# Altium schematic sheet Micro.SchDoc: Comms Board Power
size A3; DrawnBy: Scott Camp and Finn Molloy; Address1: ECE Department; Address2: University of Canterbury; Address3: Christchurch 8041; Address4: New Zealand; Revision: 1
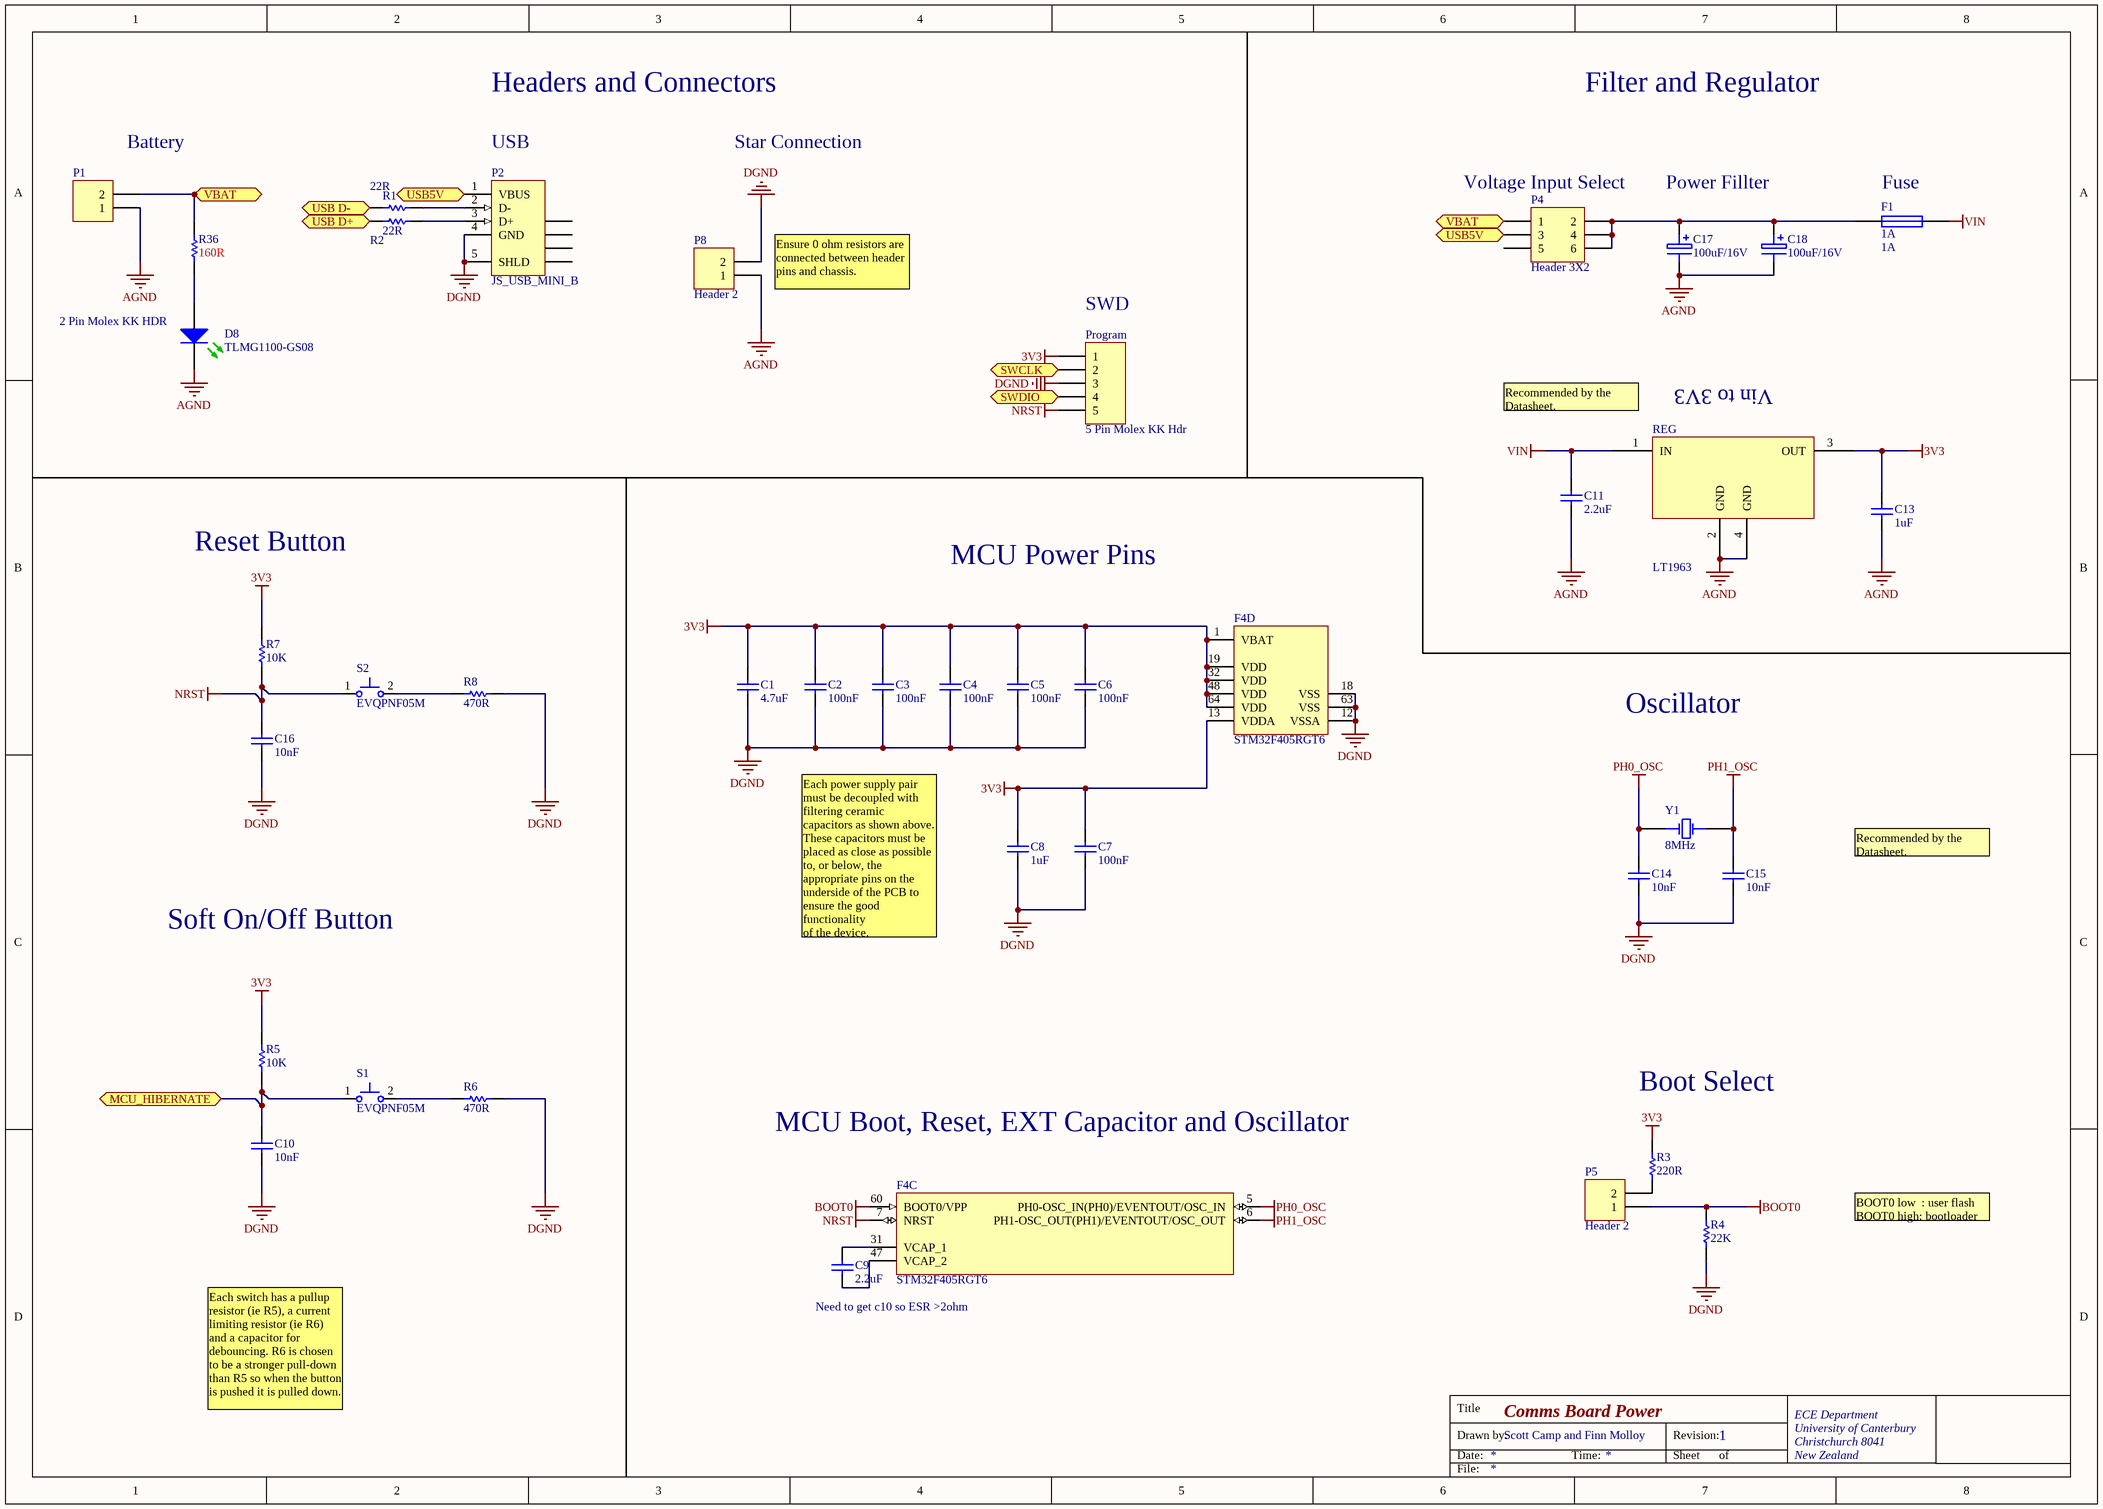
[diagram p0: Micro.SchDoc]

## Parts
C1  4.7uF  [CAPC2012L]
C2  100nF  [CAPC1005L]
C3  100nF  [CAPC1005L]
C4  100nF  [CAPC1005L]
C5  100nF  [CAPC1005L]
C6  100nF  [CAPC1005L]
C7  100nF  [CAPC1005L]
C8  1uF  [CAPC1608L]
C9  2.2uF  [CAPC2012L]
C10  10nF  [CAPC1608L]
C11  2.2uF  [CAPC2012L]
C13  1uF  [CAPC1608L]
C14  10nF  [CAPC1608L]
C15  10nF  [CAPC1608L]
C16  10nF  [CAPC1608L]
C17  100uF/16V  [NICH-1]
C18  100uF/16V  [NICH-1]
D8  TLMG1100-GS08  [LED0.8X1.6]
F1  1A  [RESC3216N]
F4  STM32F405RGT6  [TQFP64_V]  (parts C,D of 4)
P1  2 Pin Molex KK HDR  [MOLEX_KK_2_HDR]
P2  JS_USB_MINI_B  [USB/SM0.8-6H5]
P4  Header 3X2  [HDR2X3]
P5  Header 2  [HDR1X2]
P8  Header 2  [HDR1X2]
Program  5 Pin Molex KK Hdr  [MOLEX_KK_5_HDR]
R1  22R  [RESC1608L]
R2  22R  [RESC1608L]
R3  220R  [RESC1608L]
R4  22K  [RESC1608L]
R5  10K  [RESC1608L]
R6  470R  [RESC1608L]
R7  10K  [RESC1608L]
R8  470R  [RESC1608L]
R36  160R  [RESC1608L]
REG  LT1963  [SOT223-4M]
S1  EVQPNF05M  [EVQPNF05M]
S2  EVQPNF05M  [EVQPNF05M]
Y1  8MHz  [HC49/4h_SMX]

## Ports
MCU_HIBERNATE (bidir), SWCLK (bidir), SWDIO (bidir), USB5V (bidir), USB D+ (bidir), USB D- (bidir), VBAT (bidir)

## Nets
3V3: C1.2 C2.2 C3.2 C4.2 C5.2 C6.2 C7.2 C8.2 C13.2 F4.1(VBAT) F4.13(VDDA) F4.19(VDD) F4.32(VDD) F4.48(VDD) F4.64(VDD) Program.1 R3.2 R5.2 R7.2 REG.3(OUT)
AGND: C11.2 C13.1 C17.1 C18.1 D8.2(K) P1.1 P8.1 REG.2(GND) REG.4(GND)
BOOT0: F4.60(BOOT0/VPP) P5.1 R4.2
DGND: C1.1 C2.1 C3.1 C4.1 C5.1 C6.1 C7.1 C8.1 C10.1 C14.1 C15.1 C16.1 F4.12(VSSA) F4.18(VSS) F4.63(VSS) P2.4(GND) P2.5(SHLD) P8.2 Program.3 R4.1 R6.2 R8.2
NRST: C16.2 F4.7(NRST) Program.5 R7.1 S2.1
PH0_OSC: C14.2 F4.5(PH0-OSC_IN(PH0)/EVENTOUT/OSC_IN) Y1.1(OSC1)
PH1_OSC: C15.2 F4.6(PH1-OSC_OUT(PH1)/EVENTOUT/OSC_OUT) Y1.2(OSC2)
VIN: C11.1 F1.2 REG.1(IN)
MCU_HIBERNATE: C10.2 R5.1 S1.1 ; port MCU_HIBERNATE
SWCLK: Program.2 ; port SWCLK
SWDIO: Program.4 ; port SWDIO
USB5V: P2.1(VBUS) P4.3 ; port USB5V
USB D+: R2.1 ; port USB D+
USB D-: R1.1 ; port USB D-
VBAT: P1.2 P4.1 R36.2 ; port VBAT
NetC9_1: C9.1 F4.31(VCAP_1)
NetC9_2: C9.2 F4.47(VCAP_2)
NetC17_2: C17.2 C18.2 F1.1 P4.2 P4.4 P4.6
NetD8_1: D8.1(A) R36.1
NetP2_2: P2.2(D-) R1.2
NetP2_3: P2.3(D+) R2.2
NetP5_2: P5.2 R3.1
NetR6_1: R6.1 S1.2
NetR8_1: R8.1 S2.2

Not connected (* = marked no-connect by the designer): P2 6(SHLD) 7(SHLD) 8(SHLD) 9(SHLD); P4 5

## Notes on the sheet
- Headers and Connectors
- Filter and Regulator
- (near P1) Battery
- (near P2) USB
- Star Connection
- (near P4) Voltage Input Select
- Power Fillter
- (near F1) Fuse
- (near P8) Ensure 0 ohm resistors are connected between header pins and chassis.
- (near Program) SWD
- (near REG) Vin to 3V3
- (near REG) Recommended by the Datasheet.
- Reset Button
- MCU Power Pins
- Oscillator
- Recommended by the Datasheet.
- Soft On/Off Button
- Each power supply pair must be decoupled with filtering ceramic capacitors as shown above. These capacitors must be
  placed as close as possible to, or below, the appropriate pins on the underside of the PCB to ensure the good functionality
  of the device.
- Boot Select
- MCU Boot, Reset, EXT Capacitor and Oscillator
- BOOT0 low  : user flash
  BOOT0 high: bootloader
- Need to get c10 so ESR >2ohm
- Each switch has a pullup resistor (ie R5), a current limiting resistor (ie R6) and a capacitor for debouncing. R6 is chosen to be a stronger pull-down than R5 so when the button is pushed it is pulled down.
- Title
- Drawn by:
- Date:
- Time:
- Revision:
- Sheet
- of
- File:

## Library data of the parts
C1 = CC_4.7uF_0805: CAP CER 4.7uF Y5V -20% +80% 16V 0805; Note: Footprint corresponds to dimensions for bulk cassette packaging. This case size has tightened tolerances.; PackageReference: 0805; Code_IPC: 2012[0805]; Verify: *; Supplier: ECE Dept Stock; Storage Location: Pottle; Value: 4.7uF
C2-C7 = CC_100nF_0402: CAP CER 100nF X7R +-10% 16V 0402; PackageReference: 0402; Code_IPC: 1005 [0402]; Verify: *; Supplier: ECE Dept Stock; Storage Location: Pottle; Value: 100nF
C8 C13 = CC_1uF_0603: CAP CER 1uF Y5V -20% +80% 16V 0603; PackageReference: 0603; Code_IPC: 1608 [0603]; Verify: *; Supplier: ECE Dept Stock; Storage Location: Pottle; Value: 1uF
C9 C11 = CC_2.2uF_0805: CAP CER 2.2uF Y5V -20% +80% 25V 0805; Note: Footprint corresponds to dimensions for bulk cassette packaging. This case size has tightened tolerances.; PackageReference: 0805; Code_IPC: 2012[0805]; Verify: *; Supplier: ECE Dept Stock; Storage Location: Pottle; Value: 2.2uF
C10 C14-C16 = CC_10nF_0603: CAP CER 10nF X7R +-10% 50V 0603; PackageReference: 0603; Code_IPC: 1608 [0603]; Verify: *; Supplier: ECE Dept Stock; Storage Location: Pottle; Value: 10nF
C17 C18 = CA_100uF_16V_SMD: Nichcon WX series  SMT Aluminium Electrolytic Cap; Manufacturer PN: UWX1C101MCL1GB; Value: 100uF @ 16V; Manufacturer: Nichcon; Supplier 1: ECE Stock
D8 = DL_TLMG1100: LED Green 0603; Manufacturer: Vishay Semiconductor Opto Division; Millicandela Rating: 35mcd; Voltage - Forward (Vf) Typ: 2.1V; Viewing Angle: 160°; Wavelength - Peak: 572nm; Supplier 1: Farnell; Supplier 2: Digi-Key; Color: Green; Package / Case: 0603 (1608 Metric); Packaging: Cut Tape (CT); Size / Dimension: 1.60mm L x 0.80mm W; Pricing: 1=0.67, 10=0.525, 25=0.4376, 100=0.359, 250=0.29912, 500=0.24852, 1000=0.18408 (NZD); Supplier Part Number 1: 2293494; Supplier Part Number 2: 751-1165-1-ND; Manufacturer Part Number: TLMG1100-GS08
F1 = FS_Fuse_1.0A_SMD_1206: Fuse 1.0A Very Fast Acting 1206; Manufacturer: Multicomp; Manufacturer PN: MC12CF 001; Supplier: Lab Stock; Storage Location: *; Value: 1A
F4 = STM32F405RGT6: ARM Cortex-M4 32b MCU+FPU, 210DMIP, 1024 kB Flash, 192+4 kB RAM, 51 I/Os, 64-pin LQFP, -40 to +85°C, Tray; Internal RAM: 192kB; Operating Frequency (Processor Speed): 168MHz; A/D Converter: 16x12-bit; D/A Converter: 2x12-bit; 16-bit Timers (IC/OC/PWM): 12x16-bit(24/24/30); 32-bit Timer (IC/OC/PWM): 2x32-bit (8/8/8); Other Timer Functions: 2xWDG, RTC, 24-bit down counter; Serial Interface: 3xSPI/2xI2S/2xI2C/3xUSART(IrDa, ISO7816)/3xUART/1xUSB OTG FS/HS, 2xCAN/ SDIO; DatasheetVersion: rev2, Jan-2012; PackageVersion: 2012; PackageReference: TQFP64; PackageDescription: 64-Pin Low Profile Quad Flat Package, 10x10 mm Body, 0.5 mm Pitch; ComponentLink1Description: Manufacturer URL; ComponentLink1URL: http://www.st.com/; ComponentLink2Description: STM32F405/7 Datasheet; ComponentLink2URL: http://www.st.com/internet/com/TECHNICAL_RESOURCES/TECHNICAL_LITERATURE/DATASHEET/DM00037051.pdf; ComponentLink3Description: STM32F4 Web Page; ComponentLink3URL: http://www.st.com/internet/mcu/subclass/1521.jsp
P1 = JA_MOLEX_KK_2POS: CONN HEADER 2POS 2.54mm VERT_Thru Hole; Supplier 1: Farnell; Supplier Part Number 1: 1462926; Supplier 2: ECE Store; Value: 2 Pin Molex KK HDR
P2 = JS_USB_MINI_B_SMT: USB 2.0, Right Angle, SMT, B Type, Receptacle, 5 Position,; Manufacturer: FCI; Manufacturer PN: 10033526-N3212MLF; Supplier 1: Farnell; Supplier Part Number 1: 1824416; Supplier 2: ECE Stock
P4 = Header 3X2: Header, 3-Pin, Dual row; LatestRevisionDate: 17-Jul-2002; LatestRevisionNote: Re-released for DXP Platform.; Publisher: Altium Limited
P5 P8 = Header 2: Header, 2-Pin; LatestRevisionDate: 17-Jul-2002; LatestRevisionNote: Re-released for DXP Platform.; Publisher: Altium Limited
Program = JA_MOLEX_KK_5POS: CONN HEADER 5POS 2.54mm VERT_Thru Hole; Manufacturer: Molex; Manufacturer PN: 22-23-2051; Supplier 1: ECE Dept Store; Value: 5 Pin Molex KK Hdr
R1 R2 = RS_22R: RES 22 OHM 1/10W 5% 0603 SMD; Storage Location: ProtoPlace; Supplier: ECE Dept Stock; Value: 22R
R3 = RS_220R: RES 220 OHM 1/10W 5% 0603 SMD; Storage Location: ProtoPlace; Supplier: ECE Dept Stock; Value: 220R
R4 = RS_22K: RES 22.0K OHM 1/10W 5% 0603 SMD; Storage Location: ProtoPlace; Supplier: ECE Dept Stock; Value: 22K
R5 R7 = RS_10K: RES 10.0K OHM 1/10W 5% 0603 SMD; Storage Location: ProtoPlace; Supplier: ECE Dept Stock; Value: 10K
R6 R8 = RS_470R: RES 470 OHM 1/10W 5% 0603 SMD; Storage Location: ProtoPlace; Supplier: ECE Dept Stock; Value: 470R
R36 = RS_160R: RES 160 OHM 1/10W 5% 0603 SMD; Storage Location: Red Pottel; Supplier: ECE Dept Stock; Value: 160R
S1 S2 = WS_EVQPNF05M: Panasonic 6 x 3.5mm SMD Light Touch Switch Type; PackageDescription: 6.0 x 3.5 mm; Supplier 1: Farnell; Supplier Part Number 1: 2079481; Manufacturer: Panasonic; Manufacturer PN: EVQPNF05M
Y1 = XT_8MHz_HC49/4H: CRYSTAL 8.00 MHZ 18PF SMD; Manufacturer: Abracon Corporation; Manufacturer PN: ABLS-8.000MHZ-B2-T; Supplier 1: Digi-Key; Supplier Part Number 1: 535-9089-6-ND; Value: 8MHz